# Altium schematic sheet Schema_Horloge_DCF.SchDoc
size A4; SheetNumber: 1; SheetTotal: 1
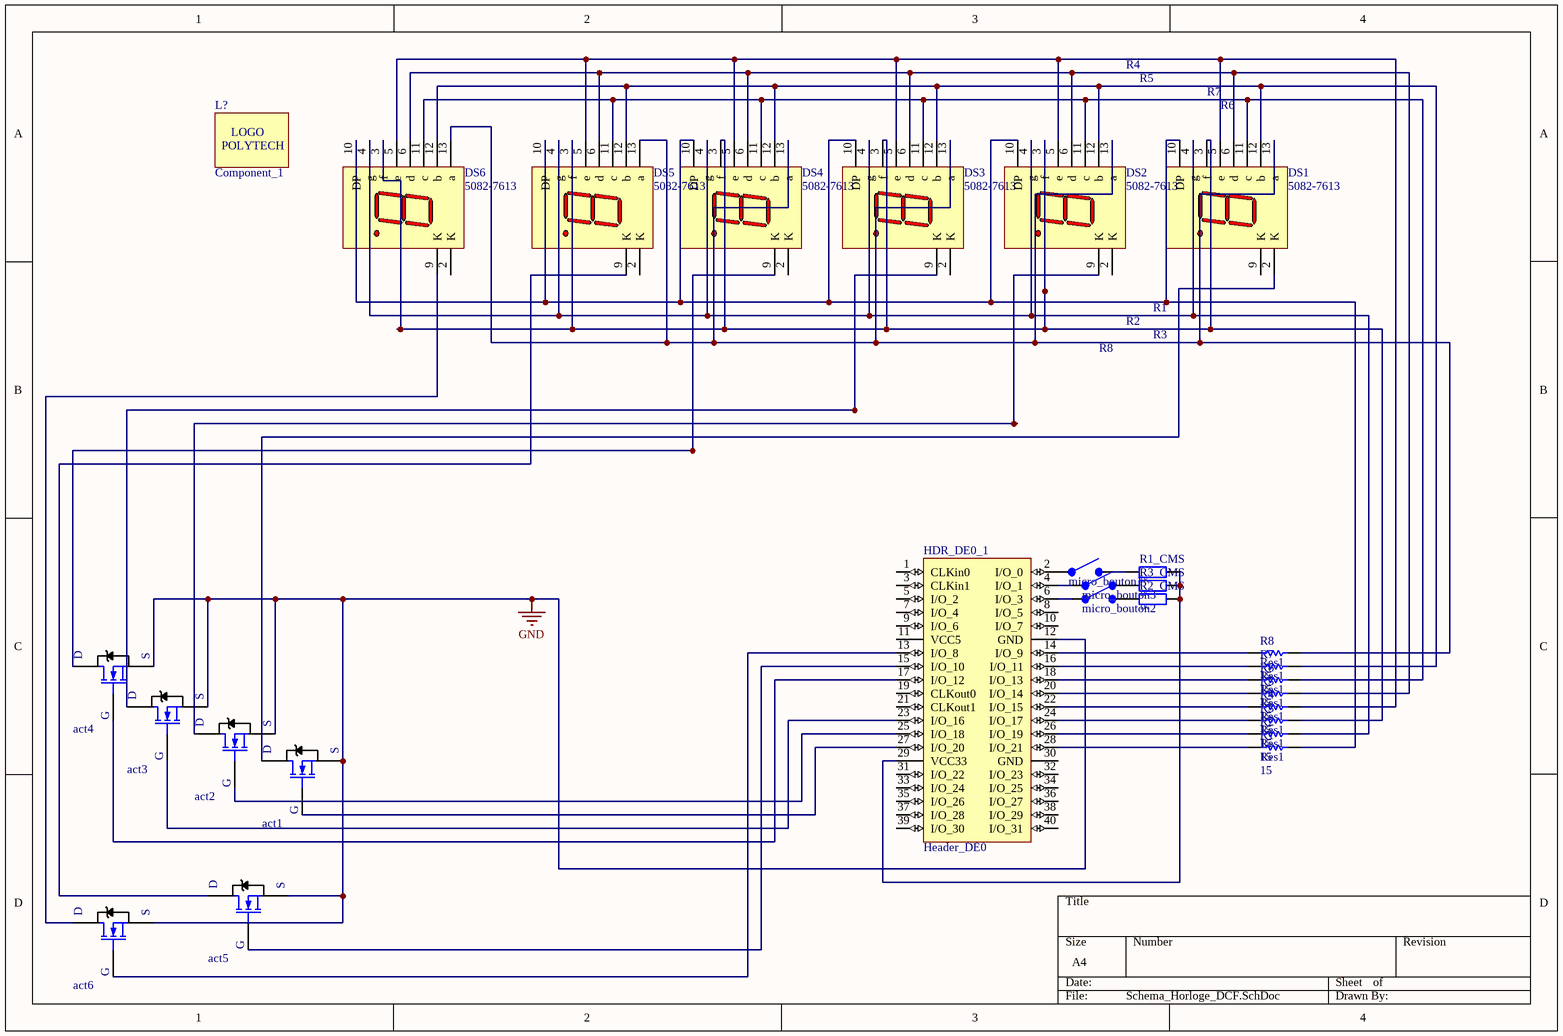
[diagram p0: Schema_Horloge_DCF.SchDoc]

## Parts
act1  T_NMOS_60V_150mA_SOT23  [Diodes_SOT23_0]  (value not drawn)
act2  T_NMOS_60V_150mA_SOT23  [Diodes_SOT23_0]  (value not drawn)
act3  T_NMOS_60V_150mA_SOT23  [Diodes_SOT23_0]  (value not drawn)
act4  T_NMOS_60V_150mA_SOT23  [Diodes_SOT23_0]  (value not drawn)
act5  T_NMOS_60V_150mA_SOT23  [Diodes_SOT23_0]  (value not drawn)
act6  T_NMOS_60V_150mA_SOT23  [Diodes_SOT23_0]  (value not drawn)
DS1  5082-7613  [A-10(14)]
DS2  5082-7613  [A-10(14)]
DS3  5082-7613  [A-10(14)]
DS4  5082-7613  [A-10(14)]
DS5  5082-7613  [A-10(14)]
DS6  5082-7613  [A-10(14)]
HDR_DE0_1  Header_DE0  [ALTERA DE]
L?  Component_1  [POLYTECH_11MM_EMPTY]
micro_bouton1  micro_bouton_poussoir  [Tactile Switch]  (value not drawn)
micro_bouton2  micro_bouton_poussoir  [Tactile Switch]  (value not drawn)
micro_bouton3  micro_bouton_poussoir  [Tactile Switch]  (value not drawn)
R1  Res1  value 15  [AXIAL-0.3]
R1_CMS  value 1K  [RESC2012X05N]  (hidden comment: R_01K0_0805)
R2  Res1  value 15  [AXIAL-0.3]
R2_CMS  value 1K  [RESC2012X05N]  (hidden comment: R_01K0_0805)
R3  Res1  value 15  [AXIAL-0.3]
R3_CMS  value 1K  [RESC2012X05N]  (hidden comment: R_01K0_0805)
R4  Res1  value 15  [AXIAL-0.3]
R5  Res1  value 15  [AXIAL-0.3]
R6  Res1  value 15  [AXIAL-0.3]
R7  Res1  value 15  [AXIAL-0.3]
R8  Res1  value 15  [AXIAL-0.3]

## Nets
GND: act1.3(S) act2.3(S) act3.3(S) act4.3(S) act5.3(S) act6.3(S) HDR_DE0_1.12(GND)
Netact1_1: act1.1(D) DS1.2(K)
Netact1_2: act1.2(G) HDR_DE0_1.27(I/O_20)
Netact2_1: act2.1(D) DS2.9(K)
Netact2_2: act2.2(G) HDR_DE0_1.25(I/O_18)
Netact3_1: act3.1(D) DS3.9(K)
Netact3_2: act3.2(G) HDR_DE0_1.23(I/O_16)
Netact4_1: act4.1(D) DS4.9(K)
Netact4_2: act4.2(G) HDR_DE0_1.17(I/O_12)
Netact5_1: act5.1(D) DS5.9(K)
Netact5_2: act5.2(G) HDR_DE0_1.15(I/O_10)
Netact6_1: act6.1(D) DS6.9(K)
Netact6_2: act6.2(G) HDR_DE0_1.13(I/O_8)
NetDS1_3: DS1.3(f) DS2.3(f) DS3.3(f) DS4.3(f) DS5.3(f) DS6.3(f) R3.2
NetDS1_4: DS1.4(g) DS2.4(g) DS3.4(g) DS4.4(g) DS5.4(g) DS6.4(g) R2.2
NetDS1_5: DS1.5(e) DS2.5(e) DS3.5(e) DS4.5(e) DS5.5(e) DS6.5(e) R4.2
NetDS1_6: DS1.6(d) DS2.6(d) DS3.6(d) DS4.6(d) DS5.6(d) DS6.6(d) R5.2
NetDS1_10: DS1.10(DP) DS2.10(DP) DS3.10(DP) DS4.10(DP) DS5.10(DP) DS6.10(DP) R1.2
NetDS1_11: DS1.11(c) DS2.11(c) DS3.11(c) DS4.11(c) DS5.11(c) DS6.11(c) R6.2
NetDS1_12: DS1.12(b) DS2.12(b) DS3.12(b) DS4.12(b) DS5.12(b) DS6.12(b) R7.2
NetDS1_13: DS1.13(a) DS2.13(a) DS3.13(a) DS4.13(a) DS5.13(a) DS6.13(a) R8.2
NetHDR_DE0_1_2: HDR_DE0_1.2(I/O_0) micro_bouton1.1
NetHDR_DE0_1_4: HDR_DE0_1.4(I/O_1) micro_bouton3.1
NetHDR_DE0_1_6: HDR_DE0_1.6(I/O_3) micro_bouton2.1
NetHDR_DE0_1_14: HDR_DE0_1.14(I/O_9) R8.1
NetHDR_DE0_1_16: HDR_DE0_1.16(I/O_11) R7.1
NetHDR_DE0_1_18: HDR_DE0_1.18(I/O_13) R6.1
NetHDR_DE0_1_20: HDR_DE0_1.20(I/O_14) R5.1
NetHDR_DE0_1_22: HDR_DE0_1.22(I/O_15) R4.1
NetHDR_DE0_1_24: HDR_DE0_1.24(I/O_17) R3.1
NetHDR_DE0_1_26: HDR_DE0_1.26(I/O_19) R2.1
NetHDR_DE0_1_28: HDR_DE0_1.28(I/O_21) R1.1
NetHDR_DE0_1_29: HDR_DE0_1.29(VCC33) R1_CMS.2 R2_CMS.2 R3_CMS.2
Netmicro_bouton1_2: micro_bouton1.2 R1_CMS.1
Netmicro_bouton2_2: micro_bouton2.2 R2_CMS.1
Netmicro_bouton3_2: micro_bouton3.2 R3_CMS.1

Not connected (* = marked no-connect by the designer): DS1 9(K); DS2 2(K); DS3 2(K); DS4 2(K); DS5 2(K); DS6 2(K); HDR_DE0_1 1(CLKin0) 3(CLKin1) 5(I/O_2) 7(I/O_4) 8(I/O_5) 9(I/O_6) 10(I/O_7) 11(VCC5) 19(CLKout0) 21(CLKout1) 30(GND) 31(I/O_22) 32(I/O_23) 33(I/O_24) 34(I/O_25) 35(I/O_26) 36(I/O_27) 37(I/O_28) 38(I/O_29) 39(I/O_30) 40(I/O_31)

## Notes on the sheet
- R4
- R5
- R7
- R6
- R1
- R8
- R2
- R3
- (in symbol Component_1) LOGO; POLYTECH

## Library data of the parts
act1-act6 = T_NMOS_60V_150mA_SOT23: BS170F MOSFET N-CH 60V 150mA SOT23; Supplier 1: RSComponents; Supplier Part Number 1: 9227822; Mounting: YES
DS1-DS6 = 5082-7613: 7.62 mm HER 7-Segment Display: CC, RH DP; LuminousIntensity: 340 ucd (Minimum).; LED_Colour: High Efficiency Red (HER); Note: Pins 2 and 9 are redundant Cathodes.; Note: No pins are present in positions 1, 7, 8 and 14.; Published: 26-May-2004; LatestRevisionDate: 11-Oct-2004; LatestRevisionNote: Display outline superimposed on PCB Footprint.; DatasheetDocument: 27-Aug-2001; PackageDocument: 27-Aug-2001; PackageReference: A-10(14); Publisher: Altium Limited; ComponentLink1Description: Manufacturer Link; ComponentLink1URL: http://www.agilent.com/; ComponentLink2Description: Datasheet; ComponentLink2URL: http://cp.literature.agilent.com/litweb/pdf/5988-3325EN.pdf
HDR_DE0_1 = Header_DE0: HE10 40pins DE0; Supplier 1: Farnell; Supplier Part Number 1: 2217597
L? = Component_1: Logo_POLYTECH
R1-R8 = Res1: Resistor; Published: 8-Jun-2000; LatestRevisionDate: 17-Jul-2002; LatestRevisionNote: Re-released for DXP Platform.; PackageReference: AXIAL-0.3; Publisher: Altium Limited; PackageDescription: Axial Device, Thru-Hole; 2 Leads; 0.3 in Pin Spacing
R1_CMS R2_CMS R3_CMS = R_01K0_0805: Resistor 1K Ohms 1/4W 0805 1%; Mounting: YES
micro_bouton1-micro_bouton3 = micro_bouton_poussoir: Supplier 1: Farnell; Supplier 2: Farnell; Supplier Part Number 1: 1555991; Supplier Part Number 2: 1555982